# Altium schematic sheet [02] - BLOCK DIAGRAM.SchDoc
size A3; DocumentNumber: 2; SheetNumber: 2; SheetTotal: 6
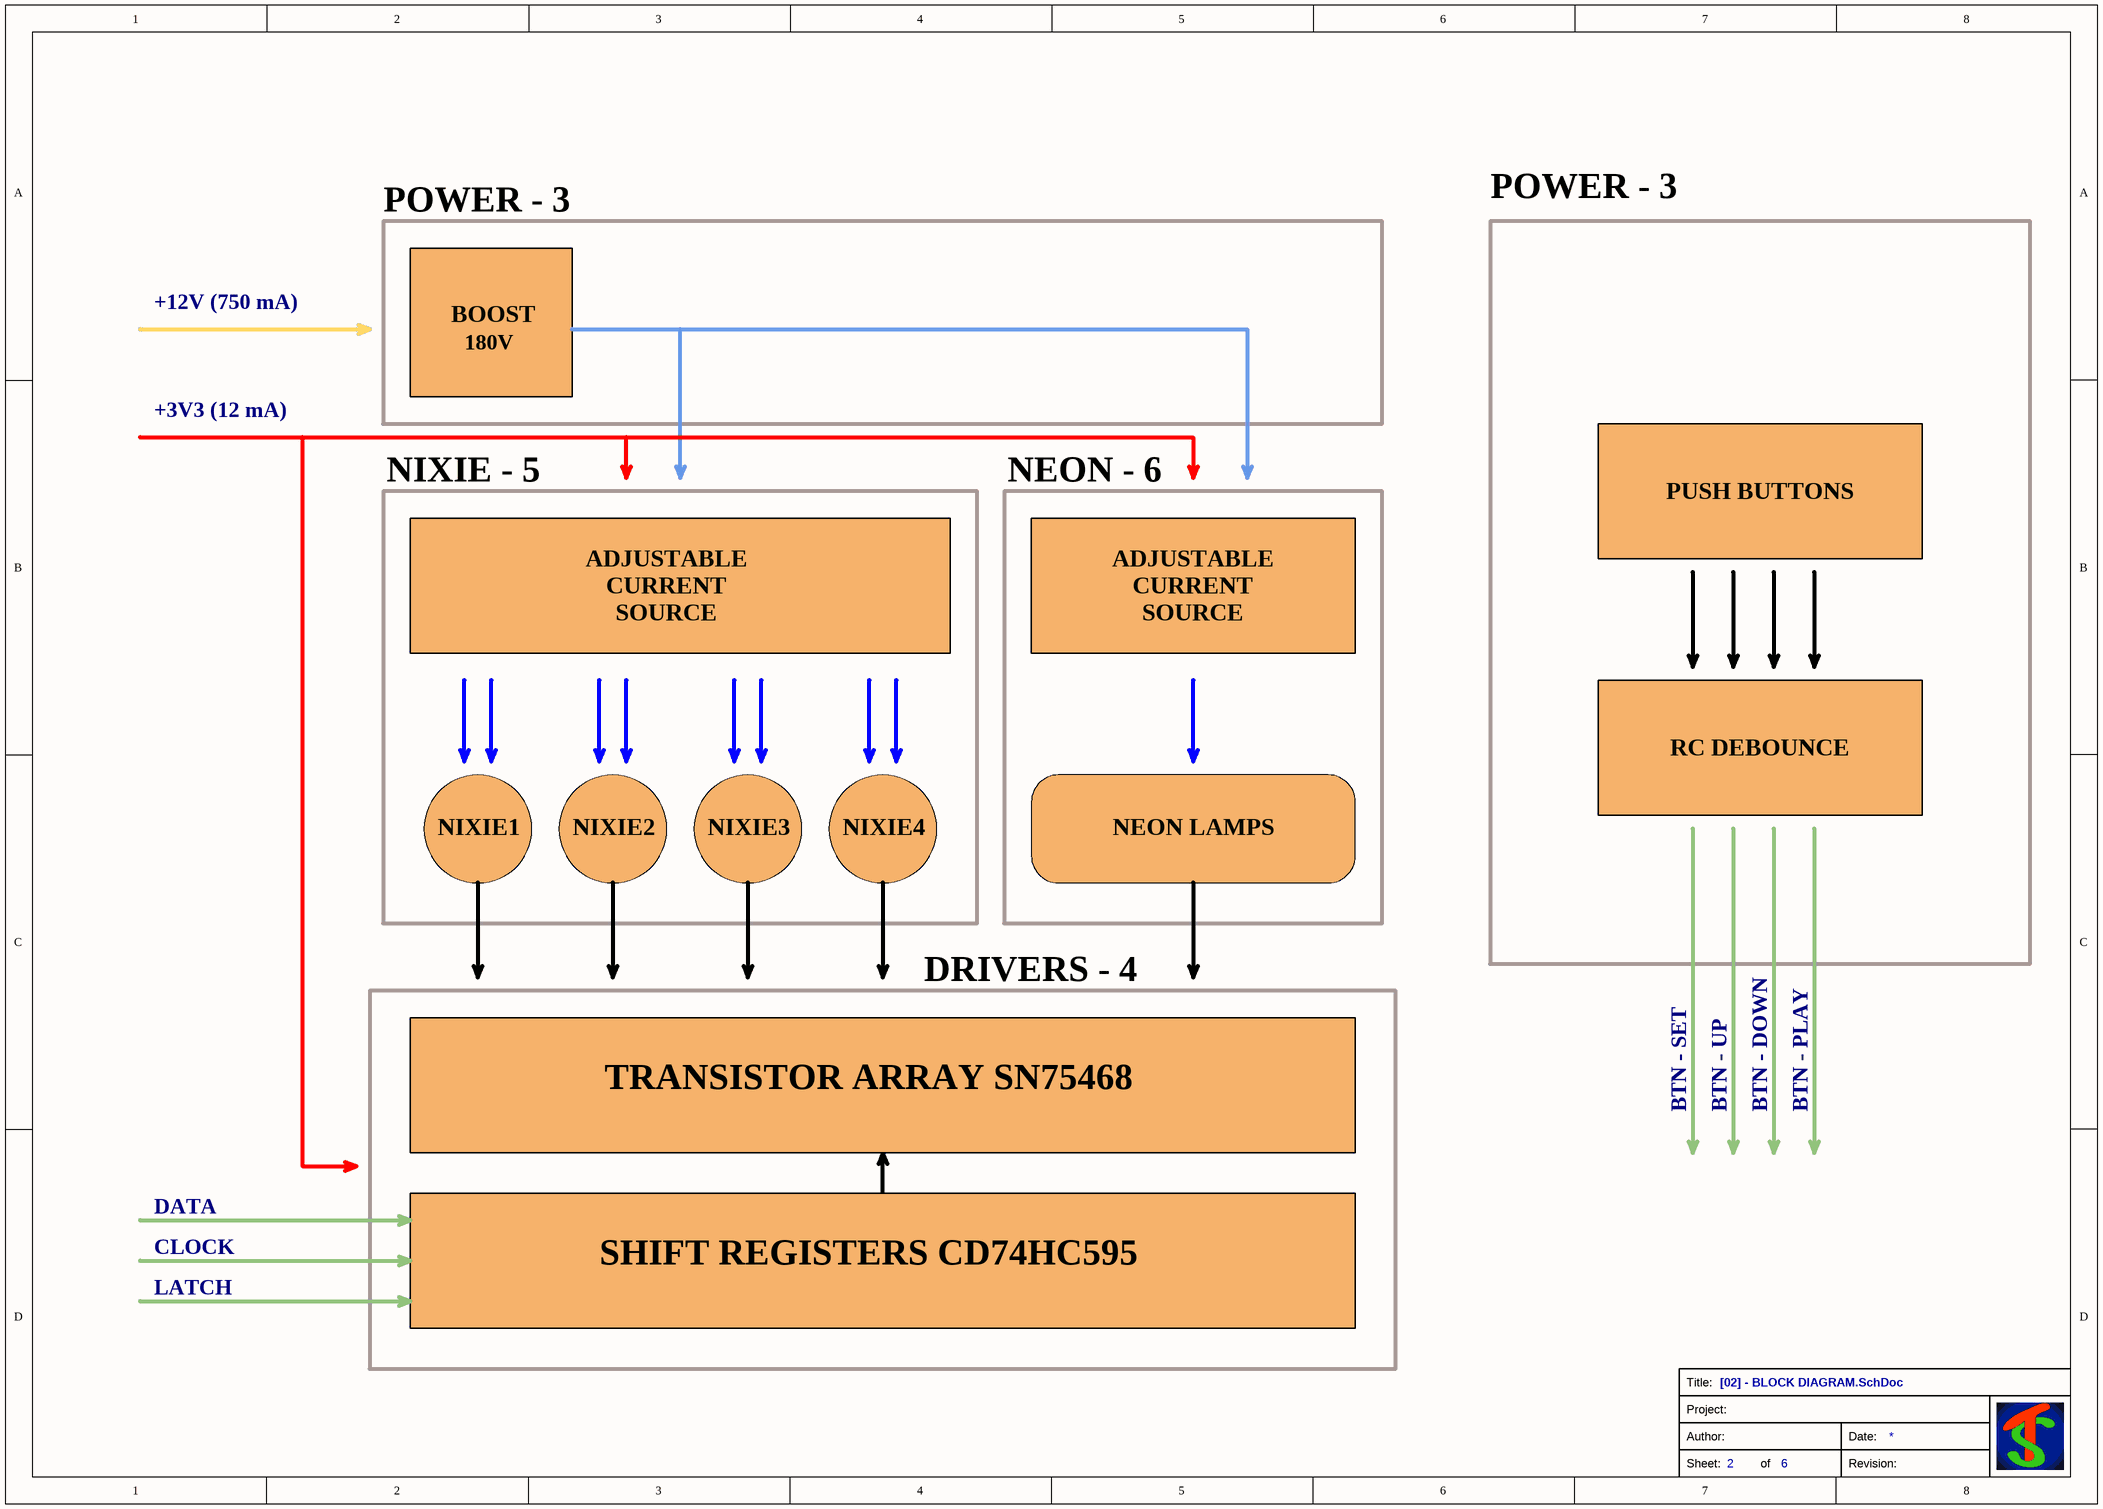
[diagram p0: [02] - BLOCK DIAGRAM.SchDoc]

## Notes on the sheet
- POWER - 3
- +12V (750 mA)
- BOOST
- 180V
- +3V3 (12 mA)
- NIXIE - 5
- NEON - 6
- PUSH BUTTONS
- ADJUSTABLE
- CURRENT
- SOURCE
- RC DEBOUNCE
- NIXIE1
- NIXIE2
- NIXIE3
- NIXIE4
- NEON LAMPS
- DRIVERS - 4
- TRANSISTOR ARRAY SN75468
- BTN - SET
- BTN - UP
- BTN - DOWN
- BTN - PLAY
- DATA
- CLOCK
- LATCH
- SHIFT REGISTERS CD74HC595
- Title:
- Project:
- Sheet:
- Author:
- of
- Revision:
- Date: